# Altium schematic sheet 2_mcu.SchDoc
size A4; SheetNumber: 2; SheetTotal: 2
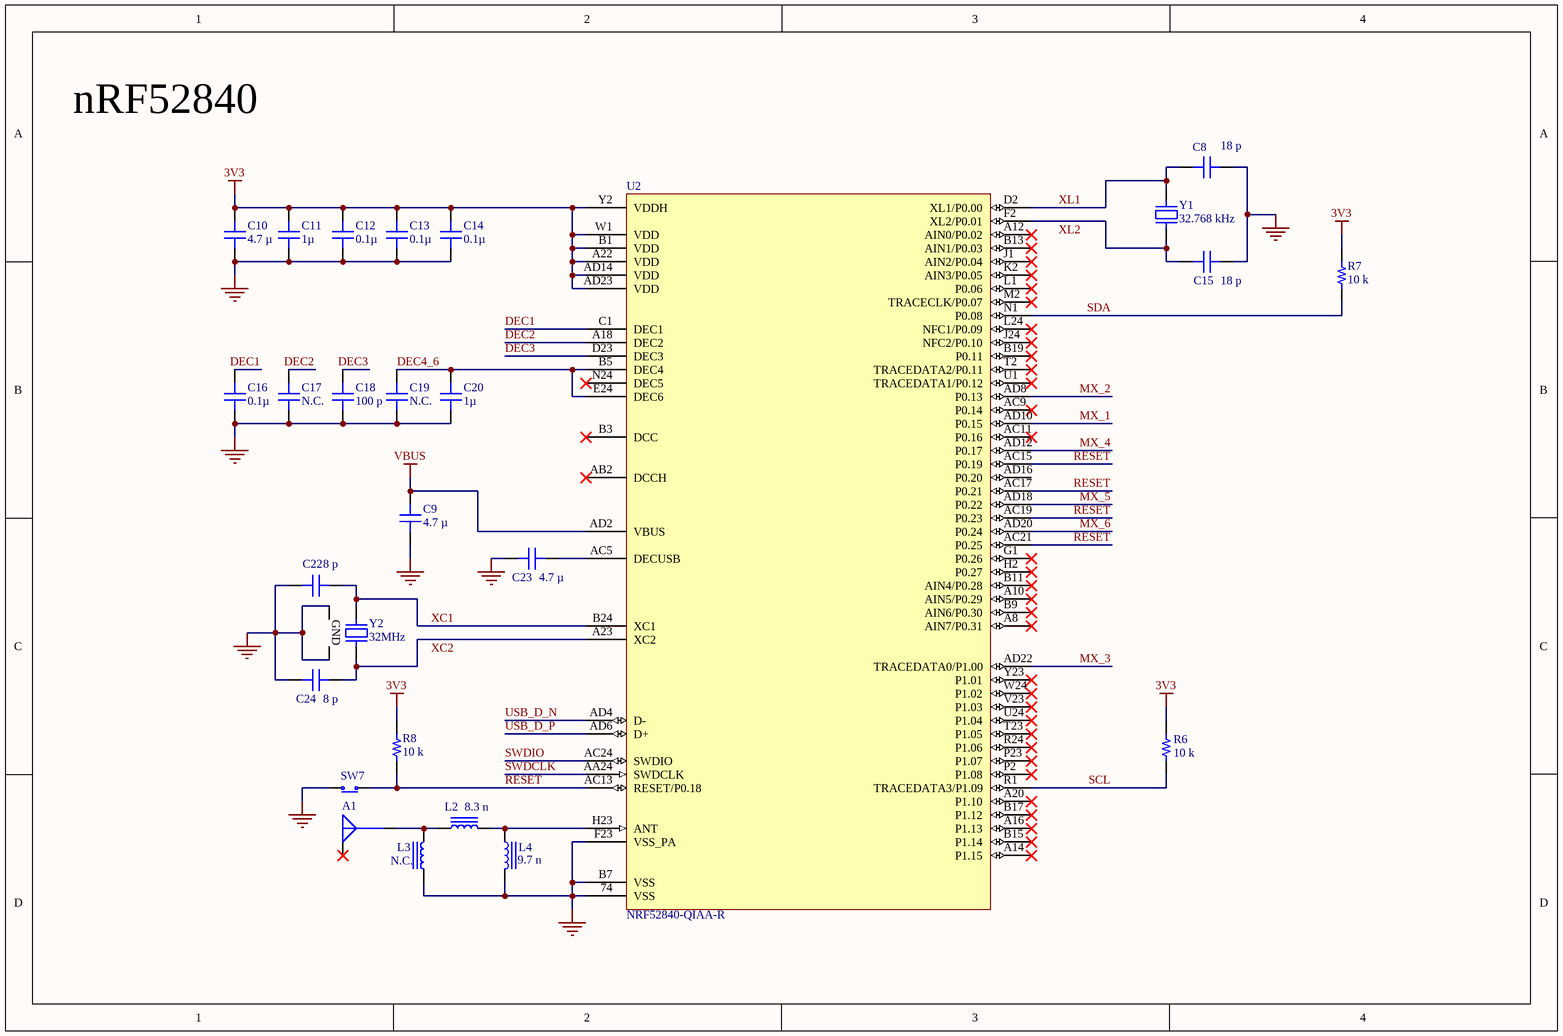
[diagram p0: 2_mcu.SchDoc]

## Parts
A1  AMCA31-2R450G-S1F-T3  [FP-AMCA31-MFG]  (value not drawn)
C8  18 p  [CAP 0402_1005]
C9  4.7 µ  [CAP 0402_1005]
C10  4.7 µ  [CAP 0402_1005]
C11  1µ  [CAP 0402_1005]
C12  0.1µ  [CAP 0402_1005]
C13  0.1µ  [CAP 0402_1005]
C14  0.1µ  [CAP 0402_1005]
C15  18 p  [CAP 0402_1005]
C16  0.1µ  [CAP 0402_1005]
C17  N.C.  [CAP 0402_1005]
C18  100 p  [CAP 0402_1005]
C19  N.C.  [CAP 0402_1005]
C20  1µ  [CAP 0402_1005]
C22  8 p  [CAP 0402_1005]
C23  4.7 µ  [CAP 0402_1005]
C24  8 p  [CAP 0402_1005]
L2  8.3 n  [IND 0402_1005]
L3  N.C.  [IND 0402_1005]
L4  9.7 n  [IND 0402_1005]
R6  10 k  [RES 0402_1005]
R7  10 k  [RES 0402_1005]
R8  10 k  [RES 0402_1005]
SW7  PTS840 GK SMTR LFS  [EVQP7A_J_B_K]  (value not drawn)
U2  NRF52840-QIAA-R  [NRSC-AQFN-73]
Y1  32.768 kHz  [ABRACON ABS06]
Y2  32MHz  [BT-XTAL_2016]

## Nets
3V3: C10.2 C11.2 C12.2 C13.2 C14.2 R6.1 R7.2 R8.1 U2.A22(VDD) U2.AD14(VDD) U2.AD23(VDD) U2.B1(VDD) U2.W1(VDD) U2.Y2(VDDH)
GND: C8.2 C9.1 C10.1 C11.1 C12.1 C13.1 C14.1 C15.2 C16.1 C17.1 C18.1 C19.1 C20.1 C22.1 C23.2 C24.1 L3.1 L4.2 SW7.1(N.O) U2.74(VSS) U2.B7(VSS) U2.F23(VSS_PA) Y2.2(GND) Y2.4(GND)
VBUS: C9.2 U2.AD2(VBUS)
DEC1: C16.2 U2.C1(DEC1)
DEC2: C17.2 U2.A18(DEC2)
DEC3: C18.2 U2.D23(DEC3)
DEC4_6: C19.2 C20.2 U2.B5(DEC4) U2.E24(DEC6)
MX_1: U2.AD10(P0.15)
MX_2: U2.AD8(P0.13)
MX_3: U2.AD22(TRACEDATA0/P1.00)
MX_4: U2.AD12(P0.17)
MX_5: U2.AD18(P0.22)
MX_6: U2.AD20(P0.24)
RESET: R8.2 SW7.2(COM) U2.AC13(RESET/P0.18) U2.AC15(P0.19) U2.AC17(P0.21) U2.AC19(P0.23) U2.AC21(P0.25)
SCL: R6.2 U2.R1(TRACEDATA3/P1.09)
SDA: R7.1 U2.N1(P0.08)
SWDCLK: U2.AA24(SWDCLK)
SWDIO: U2.AC24(SWDIO)
USB_D_N: U2.AD4(D-)
USB_D_P: U2.AD6(D+)
XC1: C22.2 U2.B24(XC1) Y2.1(IN)
XC2: C24.2 U2.A23(XC2) Y2.3(OUT)
XL1: C8.1 U2.D2(XL1/P0.00) Y1.2
XL2: C15.1 U2.F2(XL2/P0.01) Y1.1
NetA1_1: A1.1(Feed_Point) L2.1 L3.2
NetC23_1: C23.1 U2.AC5(DECUSB)
NetL2_2: L2.2 L4.1 U2.H23(ANT)

Not connected (* = marked no-connect by the designer): A1 2(NC)*; U2 A8(AIN7/P0.31)* A10(AIN5/P0.29)* A12(AIN0/P0.02)* A14(P1.15)* A16(P1.13)* A20(P1.10)* AB2(DCCH)* AC9(P0.14)* AC11(P0.16)* AD16(P0.20) B3(DCC)* B9(AIN6/P0.30)* B11(AIN4/P0.28)* B13(AIN1/P0.03)* B15(P1.14)* B17(P1.12)* B19(P0.11)* G1(P0.26)* H2(P0.27)* J1(AIN2/P0.04)* J24(NFC2/P0.10)* K2(AIN3/P0.05)* L1(P0.06)* L24(NFC1/P0.09)* M2(TRACECLK/P0.07)* N24(DEC5)* P2(P1.08)* P23(P1.07)* R24(P1.06)* T2(TRACEDATA2/P0.11)* T23(P1.05)* U1(TRACEDATA1/P0.12)* U24(P1.04)* V23(P1.03)* W24(P1.02)* Y23(P1.01)*

## Notes on the sheet
- nRF52840
- Title:
- Project:
- Revision:
- Organization:
- Date:
- Sheet
- of
- University of South Florida
- Drawn by:
- File:
- Size:

## Library data of the parts
A1 = CMP-00025-00004-1: 2.45GHz Bluetooth, IoT, ISM, M2M, Wi-Fi, ZigBee™ Chip RF Antenna 2.4GHz ~ 2.5GHz 2.3dBi Solder Surface Mount; Power - Max: 3 W; Impedance: 50Ω; RF Family/Standard: Bluetooth, General ISM, WiFi; Frequency: 2.45GHz; Case/Package: Chip; RoHS Compliant: ROHS3 Compliant; Pins: 2; Gain: 2.3dBi; Max Operating Temperature: 85°C; Mounting Technology: Surface Mount; Min Operating Temperature: -40°C
C8 C15 = HMK105CG180JV-F: CAP CER 18PF 100V C0G/NP0 0402; manufacturer: Taiyo Yuden; Temperature Coefficient: C0G, NP0; Tolerance: ±5%; Part Number: HMK105CG180JV-F; Value: 18 p; Applications: General Purpose; Capacitance: 18 pF; componentlink1description: Datasheet; componentlink1url: http://www.yuden.co.jp/productdata/catalog/mlcc06_e.pdf; componentlink2description: DigiKey Link; componentlink2url: https://www.digikey.com/en/products/detail/taiyo-yuden/HMK105CG180JV-F/6563596; Device Package: 0402 (1005 Metric); lastupdated: 2/9/2024 8:04:38 PM; Lifecycle Status: Active; Minimum Order: 1; Mounting Type: Surface Mount, MLCC; Operating Temperature: -55°C ~ 125°C; Package / Case: 0402 (1005 Metric); packaging: TapeAndReel; partid: 1849; Part Status: Active; price: 0.03; series: M; Size / Dimension: 0.039" L x 0.020" W (1.00mm x 0.50mm); Supplier 1: DigiKey; Supplier Part Number 1: 587-5003-1-ND; Thickness (Max): 0.022" (0.55mm); Voltage - Rated: 100V
C9 C10 C23 = CL05A475MO5NUNC: CAP CER 4.7UF 16V X5R 0402; manufacturer: Samsung Electro-Mechanics; Capacitance: 4.7 µF; Tolerance: ±20%; Part Number: CL05A475MO5NUNC; Value: 4.7 µ; Applications: General Purpose; componentlink1description: Datasheet; componentlink1url: http://www.samsungsem.com/kr/support/product-search/mlcc/__icsFiles/afieldfile/2019/05/29/Data%20sheet_CL05A475MO5NUNC.pdf; componentlink2description: DigiKey Link; componentlink2url: https://www.digikey.com/en/products/detail/samsung-electro-mechanics/CL05A475MO5NUNC/5961320; Device Package: 0402 (1005 Metric); lastupdated: 2/9/2024 8:04:38 PM; Lifecycle Status: Active; Minimum Order: 1; Mounting Type: Surface Mount, MLCC; Operating Temperature: -55°C ~ 85°C; Package / Case: 0402 (1005 Metric); packaging: TapeAndReel; partid: 1760; Part Status: Active; price: 0.08; series: CL; Size / Dimension: 0.039" L x 0.020" W (1.00mm x 0.50mm); Supplier 1: DigiKey; Supplier Part Number 1: 1276-6836-1-ND; Temperature Coefficient: X5R; Thickness (Max): 0.028" (0.70mm); Voltage - Rated: 16V
C11 C20 = 885012105012: CAP CER 1UF 10V X5R 0402; manufacturer: Würth Elektronik; Capacitance: 1 µF; Tolerance: ±20%; Part Number: 885012105012; Value: 1µ; Applications: General Purpose; componentlink1description: Datasheet; componentlink1url: https://katalog.we-online.de/pbs/datasheet/885012105012.pdf; componentlink2description: DigiKey Link; componentlink2url: https://www.digikey.com/en/products/detail/würth-elektronik/885012105012/5453344; Device Package: 0402 (1005 Metric); lastupdated: 2/9/2024 8:04:38 PM; Lifecycle Status: Active; Minimum Order: 1; Mounting Type: Surface Mount, MLCC; Operating Temperature: -55°C ~ 85°C; Package / Case: 0402 (1005 Metric); packaging: TapeAndReel; partid: 1807; Part Status: Active; price: 0.16; series: WCAP-CSGP; Size / Dimension: 0.039" L x 0.020" W (1.00mm x 0.50mm); Supplier 1: DigiKey; Supplier Part Number 1: 732-7489-1-ND; Temperature Coefficient: X5R; Thickness (Max): 0.022" (0.55mm); Voltage - Rated: 10V
C12-C14 C16 C17 C19 = 0402ZC104KAT2A: CAP CER 0.1UF 10V X7R 0402; manufacturer: AVX Corporation; Capacitance: 0.1µF; Tolerance: ±10%; Part Number: 0402ZC104KAT2A; Applications: General Purpose; componentlink1description: Datasheet; componentlink1url: http://datasheets.avx.com/X7RDielectric.pdf; componentlink2description: DigiKey Link; componentlink2url: http://digikey.com/product-detail/en/avx-corporation/0402ZC104KAT2A/478-7891-1-ND/3881514; Device Package: 0402 (1005 Metric); lastupdated: 2/8/2022 12:26:59 PM; Lifecycle Status: Active; Minimum Order: 1; Mounting Type: Surface Mount, MLCC; Operating Temperature: -55°C ~ 125°C; Package / Case: 0402 (1005 Metric); packaging: TapeAndReel; partid: 1757; Part Status: Active; price: 0.09; series: -; Size / Dimension: 0.039" L x 0.020" W (1.00mm x 0.50mm); Supplier 1: DigiKey; Supplier Part Number 1: 478-7891-1-ND; Temperature Coefficient: X7R; Thickness (Max): 0.022" (0.55mm); Voltage - Rated: 10V
  C12-C14 C16: Value: 0.1µ
  C17 C19: Value: N.C.
C18 = 500X07N101MV4T: CAP CER 100PF 50V C0G/NP0 0402; manufacturer: Johanson Dielectrics Inc.; Temperature Coefficient: C0G, NP0; Tolerance: ±20%; Part Number: 500X07N101MV4T; Value: 100 p; Applications: Bypass, Decoupling; Capacitance: 100 pF; componentlink1description: Datasheet; componentlink1url: https://www.johansondielectrics.com/downloads/x2y-filter-and-decoupling-capacitors.pdf; componentlink2description: DigiKey Link; componentlink2url: https://www.digikey.com/en/products/detail/johanson-dielectrics-inc/500X07N101MV4T/2046917; Device Package: 0402 (1005 Metric); Features: Low ESL (X2Y); lastupdated: 2/9/2024 8:04:38 PM; Lifecycle Status: Active; Minimum Order: 1; Mounting Type: Surface Mount, MLCC; Operating Temperature: -55°C ~ 125°C; Package / Case: 0402 (1005 Metric); packaging: TapeAndReel; partid: 1767; Part Status: Active; price: 0.08; series: X2Y®; Size / Dimension: 0.045" L x 0.025" W (1.14mm x 0.64mm); Supplier 1: DigiKey; Supplier Part Number 1: 709-1214-1-ND; Thickness (Max): 0.020" (0.51mm); Voltage - Rated: 50V
C22 C24 = C1005NP01H080D050BA: CAP CER 8PF 50V NP0 0402; manufacturer: TDK Corporation; Temperature Coefficient: C0G, NP0; Tolerance: ±0.5pF; Part Number: C1005NP01H080D050BA; Value: 8 p; Applications: General Purpose; Capacitance: 8 pF; componentlink1description: Datasheet; componentlink1url: https://product.tdk.com/info/en/catalog/datasheets/mlcc_commercial_hightemp_en.pdf?ref_disty=digikey; componentlink2description: DigiKey Link; componentlink2url: https://www.digikey.com/en/products/detail/tdk-corporation/C1005NP01H080D050BA/3951017; Device Package: 0402 (1005 Metric); Features: High Temperature; lastupdated: 2/9/2024 8:04:37 PM; Lifecycle Status: Active; Minimum Order: 1; Mounting Type: Surface Mount, MLCC; Operating Temperature: -55°C ~ 150°C; Package / Case: 0402 (1005 Metric); packaging: TapeAndReel; partid: 2033; Part Status: Active; price: 0.01; series: C; Size / Dimension: 0.039" L x 0.020" W (1.00mm x 0.50mm); Supplier 1: DigiKey; Supplier Part Number 1: 445-13781-1-ND; Thickness (Max): 0.022" (0.55mm); Voltage - Rated: 50V
L2 = LQW15AN8N3G80D: FIXED IND 8.3NH 1.5A 0.069OHM SM; Manufacturer: Murata Electronics; DC Resistance (DCR): 69mOhm Max; Frequency - Self Resonant: 6.5GHz; Inductance Frequency - Test: 100 MHz; Material - Core: Non-Magnetic; Q @ Freq: 32 @ 250MHz; Shielding: Unshielded; Tolerance: ±2%; Type: Drum Core, Wirewound; Part Number: LQW15AN8N3G80D; ComponentLink1Description: Datasheet; ComponentLink1URL: https://search.murata.co.jp/Ceramy/image/img/P02/JELF243A-0100.pdf; ComponentLink2Description: DigiKey Link; ComponentLink2URL: https://www.digikey.com/en/products/detail/murata-electronics/LQW15AN8N3G80D/4292394; Current Rating (Amps): 1.5 A; Device Package: 0402 (1005 Metric); Height - Seated (Max): 0.024" (0.60mm); Inductance: 8.3 nH; LastUpdated: 6/3/2024 8:12:57 PM; Lifecycle Status: Active; Minimum Order: 1; Mounting Type: Surface Mount; Operating Temperature: -55°C ~ 125°C; Package / Case: 0402 (1005 Metric); Packaging: TapeAndReel; PartId: 4902; Part Status: Active; Price: 0.07; Series: LQW15; Size / Dimension: 0.039" L x 0.024" W (1.00mm x 0.60mm); Supplier 1: DigiKey; Supplier Part Number 1: 490-7681-1-ND; Value: 8.3 n
L3 = LQW15AN8N3G80D: FIXED IND 8.3NH 1.5A 0.069OHM SM; Manufacturer: Murata Electronics; DC Resistance (DCR): 69mOhm Max; Frequency - Self Resonant: 6.5GHz; Inductance Frequency - Test: 100 MHz; Material - Core: Non-Magnetic; Q @ Freq: 32 @ 250MHz; Shielding: Unshielded; Tolerance: ±2%; Type: Drum Core, Wirewound; Value: 8.3 n; Part Number: LQW15AN8N3G80D; ComponentLink1Description: Datasheet; ComponentLink1URL: https://search.murata.co.jp/Ceramy/image/img/P02/JELF243A-0100.pdf; ComponentLink2Description: DigiKey Link; ComponentLink2URL: https://www.digikey.com/en/products/detail/murata-electronics/LQW15AN8N3G80D/4292394; Current Rating (Amps): 1.5 A; Device Package: 0402 (1005 Metric); Height - Seated (Max): 0.024" (0.60mm); Inductance: 8.3 nH; LastUpdated: 6/3/2024 8:12:57 PM; Lifecycle Status: Active; Minimum Order: 1; Mounting Type: Surface Mount; Operating Temperature: -55°C ~ 125°C; Package / Case: 0402 (1005 Metric); Packaging: TapeAndReel; PartId: 4902; Part Status: Active; Price: 0.07; Series: LQW15; Size / Dimension: 0.039" L x 0.024" W (1.00mm x 0.60mm); Supplier 1: DigiKey; Supplier Part Number 1: 490-7681-1-ND
L4 = LQW15AN9N7J80D: FIXED IND 9.7NH 1.4A 81 MOHM SMD; Manufacturer: Murata Electronics; DC Resistance (DCR): 81mOhm Max; Frequency - Self Resonant: 6GHz; Inductance Frequency - Test: 100 MHz; Material - Core: Non-Magnetic; Q @ Freq: 33 @ 250MHz; Shielding: Unshielded; Tolerance: ±5%; Type: Wirewound; Part Number: LQW15AN9N7J80D; ComponentLink1Description: Datasheet; ComponentLink1URL: https://search.murata.co.jp/Ceramy/image/img/P02/JELF243A-0100.pdf; ComponentLink2Description: DigiKey Link; ComponentLink2URL: https://www.digikey.com/en/products/detail/murata-electronics/LQW15AN9N7J80D/4292401; Current Rating (Amps): 1.4 A; Device Package: 0402 (1005 Metric); Height - Seated (Max): 0.024" (0.60mm); Inductance: 9.7 nH; LastUpdated: 6/3/2024 8:13:02 PM; Lifecycle Status: Active; Minimum Order: 1; Mounting Type: Surface Mount; Operating Temperature: -55°C ~ 125°C; Package / Case: 0402 (1005 Metric); Packaging: TapeAndReel; PartId: 4964; Part Status: Active; Price: 0.06; Series: LQW15; Size / Dimension: 0.039" L x 0.024" W (1.00mm x 0.60mm); Supplier 1: DigiKey; Supplier Part Number 1: 490-7688-1-ND; Value: 9.7 n
R6-R8 = RP73PF1E10KBTD: RES 10K OHM 0.1% 1/10W 0402; Manufacturer: TE Connectivity Passive Product; Power (Watts): 0.1W, 1/10W; Resistance: 10 kOhms; Temperature Coefficient: ±25ppm/°C; Part Number: RP73PF1E10KBTD; Value: 10 k; ComponentLink1Description: Datasheet; ComponentLink1URL: https://www.te.com/commerce/DocumentDelivery/DDEController?Action=srchrtrv&DocNm=1773272&DocType=DS&DocLang=English; ComponentLink2Description: DigiKey Link; ComponentLink2URL: https://www.digikey.com/en/products/detail/te-connectivity-passive-product/RP73PF1E10KBTD/8260957; Composition: Thin Film; Device Package: 0402 (1005 Metric); Height - Seated (Max): 0.014" (0.35mm); LastUpdated: 2/9/2024 8:30:24 PM; Lifecycle Status: Active; Minimum Order: 1; Number of Terminations: 2; Operating Temperature: -55°C ~ 155°C; Package / Case: 0402 (1005 Metric); Packaging: TapeAndReel; PartId: 2434; Part Status: Active; Price: 0.08; Series: RP73, Holsworthy; Size / Dimension: 0.039" L x 0.020" W (1.00mm x 0.50mm); Supplier 1: DigiKey; Supplier Part Number 1: A127415CT-ND; Supplier Device Package: 0402; Tolerance: ±0.1%
SW7 = CMP-011-00017-1: Microminiature SMT Switch, Side Actuated; Manufacturer: C&K; Part number Norautron: N.A.; Part number IPS: 00000001260; Artikkelnr Noca: 50019089; Pad Count: 4; Note: Tactile Switch, SPST, SMD, 220gf; Author: rsk; Manufacturer Part Number: PTS840 GK SMTR LFS; HelpURL: http://www.ck-components.com/80185/pts840_11june13.pdf/; Component Type: Standard; Part Number: PTS840 GK SMTR LFS; Source: pca10059.SCHLIB; ComponentLink2Description: Supplier link; ComponentLink2URL: N.A.; Component Class: Switches; Pins: 2; ComponentLink1Description: Datasheet; Published: 2014-08-12; PartId: 101500010; Value: PTS840 GK SMTR LFS; LatestRevisionDate: 2017-11-09; Design Item ID: PTS840 GK SMTR LFS; Footprint Doc: PTS840 Gx; ComponentLink1URL: N.A.
U2 = CMP-020-00027-11: IC RF TxRx + MCU 802.15.4, Bluetooth Bluetooth v5.0, Thread, Zigbee® 2.4GHz 73-VFQFN Dual Rows, Exposed Pad; RAM Size: 256kB RAM; Max Supply Voltage: 5.5V; Clock Frequency: 64MHz; I/Os: 48; Nominal Supply Voltage: 3.3V; Interface: ADC, I2S, PDM, PWM, SPI, TWI, UART, USB; Min Supply Voltage: 1.7V; Frequency: 2.4GHz; Pins: 73; Max Operating Temperature: 125°C; Case/Package: 73-VFQFN Dual Rows, Exposed Pad; JLCPCB Part #: C190794; Min Operating Temperature: -40°C; RoHS Compliant: ROHS3 Compliant; Mounting Technology: Surface Mount; Manufacturer Part #: NRF52840-QIAA-R
Y1 = ABS06-32.768KHZ-1-T: CRYSTAL 32.7680KHZ 12.5PF SMD; Manufacturer: Abracon LLC; ESR (Equivalent Series Resistance): 90 kOhms; Frequency Tolerance: ±10ppm; Operating Mode: Fundamental; Part Number: ABS06-32.768KHZ-1-T; ComponentLink1Description: Datasheet; ComponentLink1URL: https://abracon.com/Resonators/ABS06.pdf; ComponentLink2Description: DigiKey Link; ComponentLink2URL: https://www.digikey.com/en/products/detail/abracon-llc/ABS06-32-768KHZ-1-T/2217994; Frequency: 32.768 kHz; Height - Seated (Max): 0.024" (0.60mm); LastUpdated: 6/3/2024 8:02:03 PM; Lifecycle Status: Active; Load Capacitance: 12.5pF; Minimum Order: 1; Mounting Type: Surface Mount; Operating Temperature: -40°C ~ 85°C; Package / Case: 2-SMD, No Lead; Packaging: TapeAndReel; PartId: 370; Part Status: Active; Price: 0.33; Series: ABS06; Size / Dimension: 0.079" L x 0.047" W (2.00mm x 1.20mm); Supplier 1: DigiKey; Supplier Part Number 1: 535-10248-1-ND; Type: kHz Crystal (Tuning Fork); Value: 32.768 kHz
Y2 = CMP-003-00031-3: 32 MHz ±10ppm Crystal 8pF 60 Ohms 4-SMD, No Lead; ESR: 60; Min Operating Temperature: -30°C; Frequency: 32MHz; RoHS Compliant: ROHS3 Compliant; Pins: 4; Manufacturer Part #: XRCGB32M000F1H01R0; Load Capacitance: 8pF; Mounting Technology: Surface Mount; JLCPCB Part #: C914155; Max Operating Temperature: 85°C; Case/Package: 4-SMD, No Lead